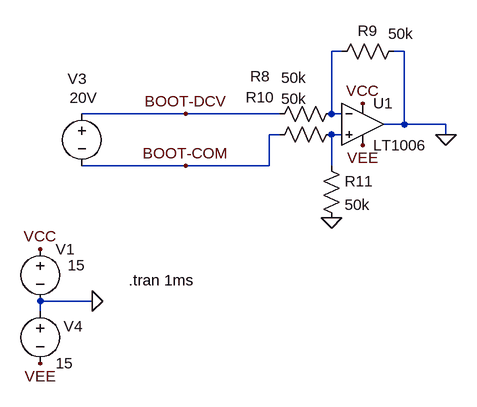
[diagram p0: schematic Draft04.asc]
Draft04.asc, the LTspice schematic file:
Version 4
SHEET 1 2756 2104
WIRE -352 -656 -368 -656
WIRE -256 -656 -272 -656
WIRE -592 -560 -752 -560
WIRE -448 -560 -592 -560
WIRE -368 -560 -368 -656
WIRE -352 -560 -368 -560
WIRE -256 -544 -256 -656
WIRE -256 -544 -288 -544
WIRE -192 -544 -256 -544
WIRE -448 -528 -464 -528
WIRE -352 -528 -368 -528
WIRE -192 -528 -192 -544
WIRE -592 -480 -752 -480
WIRE -464 -480 -464 -528
WIRE -464 -480 -592 -480
WIRE -368 -480 -368 -528
WIRE -736 -272 -816 -272
WIRE -816 -256 -816 -272
FLAG -816 -352 VCC
FLAG -816 -176 VEE
FLAG -736 -272 0
FLAG -320 -576 VCC
FLAG -320 -512 VEE
FLAG -192 -528 0
FLAG -368 -400 0
FLAG -592 -480 BOOT-COM
FLAG -592 -560 BOOT-DCV
SYMBOL voltage -816 -368 R0
WINDOW 123 0 0 Left 0
WINDOW 39 0 0 Left 0
WINDOW 3 42 41 Left 2
SYMATTR Value 15
SYMATTR InstName V1
SYMBOL voltage -816 -272 R0
WINDOW 123 0 0 Left 0
WINDOW 39 0 0 Left 0
WINDOW 0 36 39 Left 2
SYMATTR InstName V4
SYMATTR Value 15
SYMBOL OpAmps\\LT1006 -320 -608 R0
SYMATTR InstName U1
SYMBOL voltage -752 -576 R0
WINDOW 123 0 0 Left 0
WINDOW 39 0 0 Left 0
WINDOW 3 -19 -9 Left 2
WINDOW 0 -22 -38 Left 2
SYMATTR Value 20V
SYMATTR InstName V3
SYMBOL res -464 -544 R270
WINDOW 0 58 -14 VTop 2
WINDOW 3 87 38 VBottom 2
SYMATTR InstName R8
SYMATTR Value 50k
SYMBOL res -368 -640 R270
WINDOW 0 32 56 VTop 2
WINDOW 3 59 107 VBottom 2
SYMATTR InstName R9
SYMATTR Value 50k
SYMBOL res -464 -512 R270
WINDOW 0 58 -14 VTop 2
WINDOW 3 87 38 VBottom 2
SYMATTR InstName R10
SYMATTR Value 50k
SYMBOL res -384 -496 R0
SYMATTR InstName R11
SYMATTR Value 50k
TEXT -680 -304 Left 2 !.tran 1ms

The netlist it stands for:
* Draft04.asc
V1 VCC 0 15
V4 0 VEE 15
XU1 N002 N001 VCC VEE 0 LT1006  ; pins In+ In- V+ V- OUT
V3 BOOT-DCV BOOT-COM 20V
R8 BOOT-DCV N001 50k
R9 N001 0 50k
R10 BOOT-COM N002 50k
R11 N002 0 50k
.tran 1ms
.lib LTC.lib
.backanno
.end